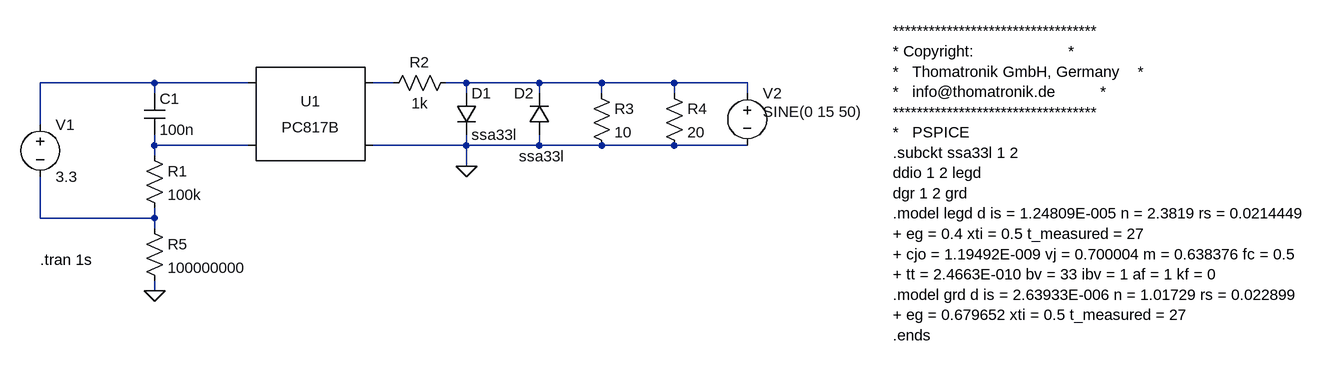
[diagram p0: schematic probe.asc]
probe.asc, the LTspice schematic file:
Version 4.1
SHEET 1 2044 1508
WIRE 208 64 32 64
WIRE 352 64 208 64
WIRE 576 64 544 64
WIRE 688 64 656 64
WIRE 800 64 688 64
WIRE 896 64 800 64
WIRE 1008 64 896 64
WIRE 1120 64 1008 64
WIRE 208 80 208 64
WIRE 688 80 688 64
WIRE 800 80 800 64
WIRE 896 80 896 64
WIRE 1008 80 1008 64
WIRE 1120 80 1120 64
WIRE 32 128 32 64
WIRE 208 160 208 144
WIRE 352 160 208 160
WIRE 688 160 688 144
WIRE 688 160 544 160
WIRE 800 160 800 144
WIRE 800 160 688 160
WIRE 896 160 800 160
WIRE 1008 160 896 160
WIRE 1120 160 1008 160
WIRE 208 176 208 160
WIRE 688 192 688 160
WIRE 32 272 32 208
WIRE 208 272 208 256
WIRE 208 272 32 272
WIRE 208 288 208 272
WIRE 208 384 208 368
FLAG 208 384 0
FLAG 688 192 0
SYMBOL voltage 32 112 R0
WINDOW 123 0 0 Left 0
WINDOW 39 0 0 Left 0
SYMATTR InstName V1
SYMATTR Value 3.3
SYMBOL cap 192 80 R0
SYMATTR InstName C1
SYMATTR Value 100n
SYMBOL res 192 160 R0
SYMATTR InstName R1
SYMATTR Value 100k
SYMBOL Optos\\PC817B 448 112 M0
SYMATTR InstName U1
SYMBOL res 672 48 R90
WINDOW 0 0 56 VBottom 2
WINDOW 3 32 56 VTop 2
SYMATTR InstName R2
SYMATTR Value 1k
SYMBOL res 880 64 R0
SYMATTR InstName R3
SYMATTR Value 10
SYMBOL voltage 1120 64 R0
WINDOW 3 24 44 Left 2
WINDOW 123 0 0 Left 0
WINDOW 39 0 0 Left 0
SYMATTR InstName V2
SYMATTR Value SINE(0 15 50)
SYMBOL res 992 64 R0
SYMATTR InstName R4
SYMATTR Value 20
SYMBOL res 192 272 R0
SYMATTR InstName R5
SYMATTR Value 100000000
SYMBOL diode 672 80 R0
SYMATTR InstName D1
SYMATTR Value ssa33l
SYMATTR Prefix X
SYMBOL diode 816 144 R180
WINDOW 0 24 64 Left 2
WINDOW 3 47 -33 Right 2
SYMATTR InstName D2
SYMATTR Value ssa33l
SYMATTR Prefix X
TEXT 32 336 Left 2 !.tran 1s
TEXT 1344 -16 Left 2 !**********************************\n* Copyright:                     *\n*   Thomatronik GmbH, Germany    *\n*   info@thomatronik.de          *\n**********************************\n*   PSPICE\n.subckt ssa33l 1 2\nddio 1 2 legd\ndgr 1 2 grd\n.model legd d is = 1.24809E-005 n = 2.3819 rs = 0.0214449\n+ eg = 0.4 xti = 0.5 t_measured = 27\n+ cjo = 1.19492E-009 vj = 0.700004 m = 0.638376 fc = 0.5\n+ tt = 2.4663E-010 bv = 33 ibv = 1 af = 1 kf = 0\n.model grd d is = 2.63933E-006 n = 1.01729 rs = 0.022899\n+ eg = 0.679652 xti = 0.5 t_measured = 27\n.ends

The netlist it stands for:
* probe.asc
V1 N001 N005 3.3
C1 N001 N004 100n
R1 N004 N005 100k
X§U1 N002 0 N001 N004 PC817 Igain=1.5m
R2 N003 N002 1k
R3 N003 0 10
V2 N003 0 SINE(0 15 50)
R4 N003 0 20
R5 N005 0 100000000
X§D1 N003 0 ssa33l  ; pins + -
X§D2 0 N003 ssa33l  ; pins + -
.tran 1s
**********************************
* Copyright:                     *
*   Thomatronik GmbH, Germany    *
*   info@thomatronik.de          *
**********************************
*   PSPICE
.subckt ssa33l 1 2
ddio 1 2 legd
dgr 1 2 grd
.model legd d is = 1.24809E-005 n = 2.3819 rs = 0.0214449
+ eg = 0.4 xti = 0.5 t_measured = 27
+ cjo = 1.19492E-009 vj = 0.700004 m = 0.638376 fc = 0.5
+ tt = 2.4663E-010 bv = 33 ibv = 1 af = 1 kf = 0
.model grd d is = 2.63933E-006 n = 1.01729 rs = 0.022899
+ eg = 0.679652 xti = 0.5 t_measured = 27
.ends
.lib PC817.sub
.backanno
.end